# Altium schematic sheet RAM.SchDoc
size A4; SheetNumber: 4; SheetTotal: 6
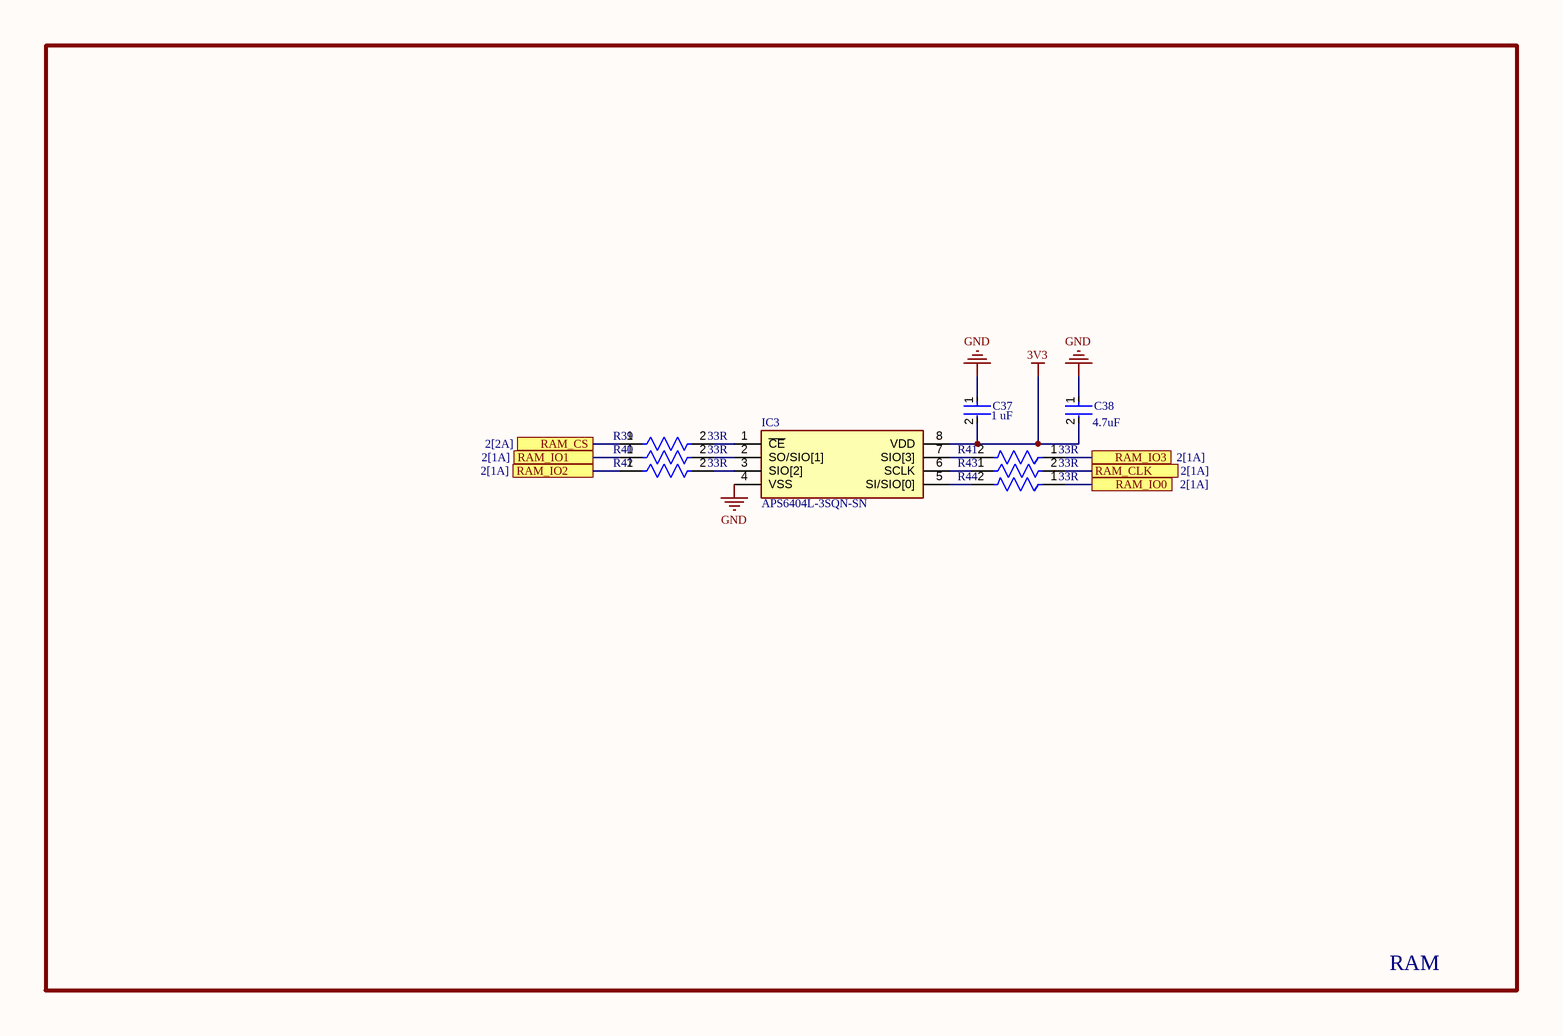
[diagram p0: RAM.SchDoc]

## Parts
C37  Capacitance: 1 uF  [FP-CC0805-0_85-MFG]  (hidden comment: CC0805KKX5R6BB105)
C38  Capacitance: 4.7uF  [FP-C2012-125-0_2-IPC_B]  (hidden comment: C2012X7R1A475K125AC)
IC3  APS6404L-3SQN-SN  [SOIC127P600X175-8N]
R39  Resistance: 33R  [FP-RMCF0805-MFG]  (hidden comment: RMCF0805FT33R0)
R40  Resistance: 33R  [FP-RMCF0805-MFG]  (hidden comment: RMCF0805FT33R0)
R41  Resistance: 33R  [FP-RMCF0805-MFG]  (hidden comment: RMCF0805FT33R0)
R42  Resistance: 33R  [FP-RMCF0805-MFG]  (hidden comment: RMCF0805FT33R0)
R43  Resistance: 33R  [FP-RMCF0805-MFG]  (hidden comment: RMCF0805FT33R0)
R44  Resistance: 33R  [FP-RMCF0805-MFG]  (hidden comment: RMCF0805FT33R0)

## Ports
RAM_CLK (see 2[1A]), RAM_CS (see 2[2A]), RAM_IO0 (see 2[1A]), RAM_IO1 (see 2[1A]), RAM_IO2 (see 2[1A]), RAM_IO3 (see 2[1A])

## Nets
3V3: C37.2 C38.2 IC3.8(VDD)
GND: C37.1 C38.1 IC3.4(VSS)
RAM_CLK: R43.2 ; port RAM_CLK
RAM_CS: R39.1 ; port RAM_CS
RAM_IO0: R44.1 ; port RAM_IO0
RAM_IO1: R40.1 ; port RAM_IO1
RAM_IO2: R42.1 ; port RAM_IO2
RAM_IO3: R41.1 ; port RAM_IO3
NetIC3_1: IC3.1(~{CE}) R39.2
NetIC3_2: IC3.2(SO/SIO[1]) R40.2
NetIC3_3: IC3.3(SIO[2]) R42.2
NetIC3_5: IC3.5(SI/SIO[0]) R44.2
NetIC3_6: IC3.6(SCLK) R43.1
NetIC3_7: IC3.7(SIO[3]) R41.2

## Notes on the sheet
- RAM
- DWG NO:
- REV:
- THIS DOCUMENT AND THE DATA DISCLOSED HEREIN OR
- HEREWITH IS THE PROPERTY OF ALTIUM LIMITED AND MAY
- BE FREELY DISTRIBUTED IN WHOLE. NO RIGHTS ARE
- RESERVED OR EXPRESS OR IMPLIED WARANTEE GIVEN.
- REVISION
- DESCRIPTION
- DATE
- APPROVED
- ENG:
- APPROVALS
- PROJECT
- DSN:
- CHK:
- REFERENCE DOCUMENTS
- PROJECT REVISION:
- TITLE
- DOCUMENT REVISION:
- DESIGN ITEM:
- BOM:
- FAB DWG:
- PCB DWG:
- ASSY DWG:
- SCALE:
- A2
- SIZE
- CAGE CODE
- FILE NAME
- DWG NO.
- SHEET
- OF
- REV

## Library data of the parts
C37 = CMP-03422-000746-1: CAP CER 1UF 10V X5R 0805; Manufacturer: Yageo; Material: Ceramic; Tolerance: 0.1; Height: 0.95mm; Mouser Description: Multilayer Ceramic Capacitors MLCC - SMD/SMT 1.0uF 10V X5R 10%; Device Class L1: Passive Components; Temperature Range High: +85°C; ComponentLink2URL: http://www.yageo.com/documents/recent/UPY-GPHC_Y5V_6.3V-to-50V_8.pdf; Lead Free: Yes; Automotive: No; Package: CC0805-0.85; Temperature Range Low: -30°C; Device Class L2: Capacitors; Octopart: https://octopart.com/cc0805kkx5r6bb105-yageo-9292777; Category: Cap; Temperature: -30°C to +85°C; Device Class L3: Ceramic Capacitors; Value: 1 uF; ComponentLink2Description: Datasheet; Manufacturer Part Number: CC0805KKX5R6BB105; Temperature Characteristic: X5R; Footprint Url: http://www.yageo.com/exep/pages/download/literatures/UPY-C_GEN_24.pdf; RoHS: TRUE; Ipc Land Pattern Name: CAPC200125X85; Voltage Rating: 10 V; Digikey Description: CAP CER 1UF 10V X5R 0805
C38 = CMP-08246-006484-1: Multilayer Ceramic Capacitors 4.7μF ±10% 10V X7R SMD 0805; Dielectric: X7R; Thickness: 0.057inch; Min Operating Temperature: -55°C; Width: 0.049inch; Construction: Flat; Lead Free: Lead Free; Case Code (Imperial): 0805; Number of Pins: 2; RoHS Compliant: Yes; Termination: SMD/SMT; Tolerance: 10%; Resistor Type: Ceramic; Series: C; Voltage Rating: 10V; Depth: 1.25mm; Height: 1.25mm; Max Operating Temperature: 125°C; Mount: Surface Mount; Package Quantity: 2000; Weight: 0.000194oz; Radiation Hardening: No; REACH SVHC: No SVHC; Case Code (Metric): 2012; Length: 2mm; Packaging: Tape and Reel; Case/Package: 0805; Dielectric Material: Ceramic; Voltage Rating (DC): 10V
IC3 = APS6404L-3SQN-SN: Integrated Circuit; Manufacturer_Name: apmemory; Datasheet Link: https://www.mouser.es/datasheet/2/1127/APM_PSRAM_E3_QSPI__APS6404L_SQH_KGD_PKG__v4_1-3623360.pdf; Height: 1.75mm; Manufacturer_Part_Number: APS6404L-3SQN-SN
R39-R44 = CMP-26527-003272-1: 33Ω ±1% 0.125W 0805 Thick Film Chip Resistor AEC-Q200 compliant; Max Power Dissipation: 125mW; Temperature Coefficient: 100ppm/°C; Height: 0.026inch; Contact Plating: Tin; Features: Automotive AEC-Q200; RoHS Compliant: Yes; Number of Terminations: 2; Min Operating Temperature: -55°C; Length: 0.079inch; Case/Package: 0805; Case Code (Metric): 2012; Series: RMCF; Width: 0.049inch; Mount: Surface Mount; Radiation Hardening: No; Case Code (Imperial): 0805; Tolerance: 1%; Packaging: Tape and Reel; Max Operating Temperature: 155°C; Resistor Type: Thick Film